# Altium project Motherboard.PrjPcb
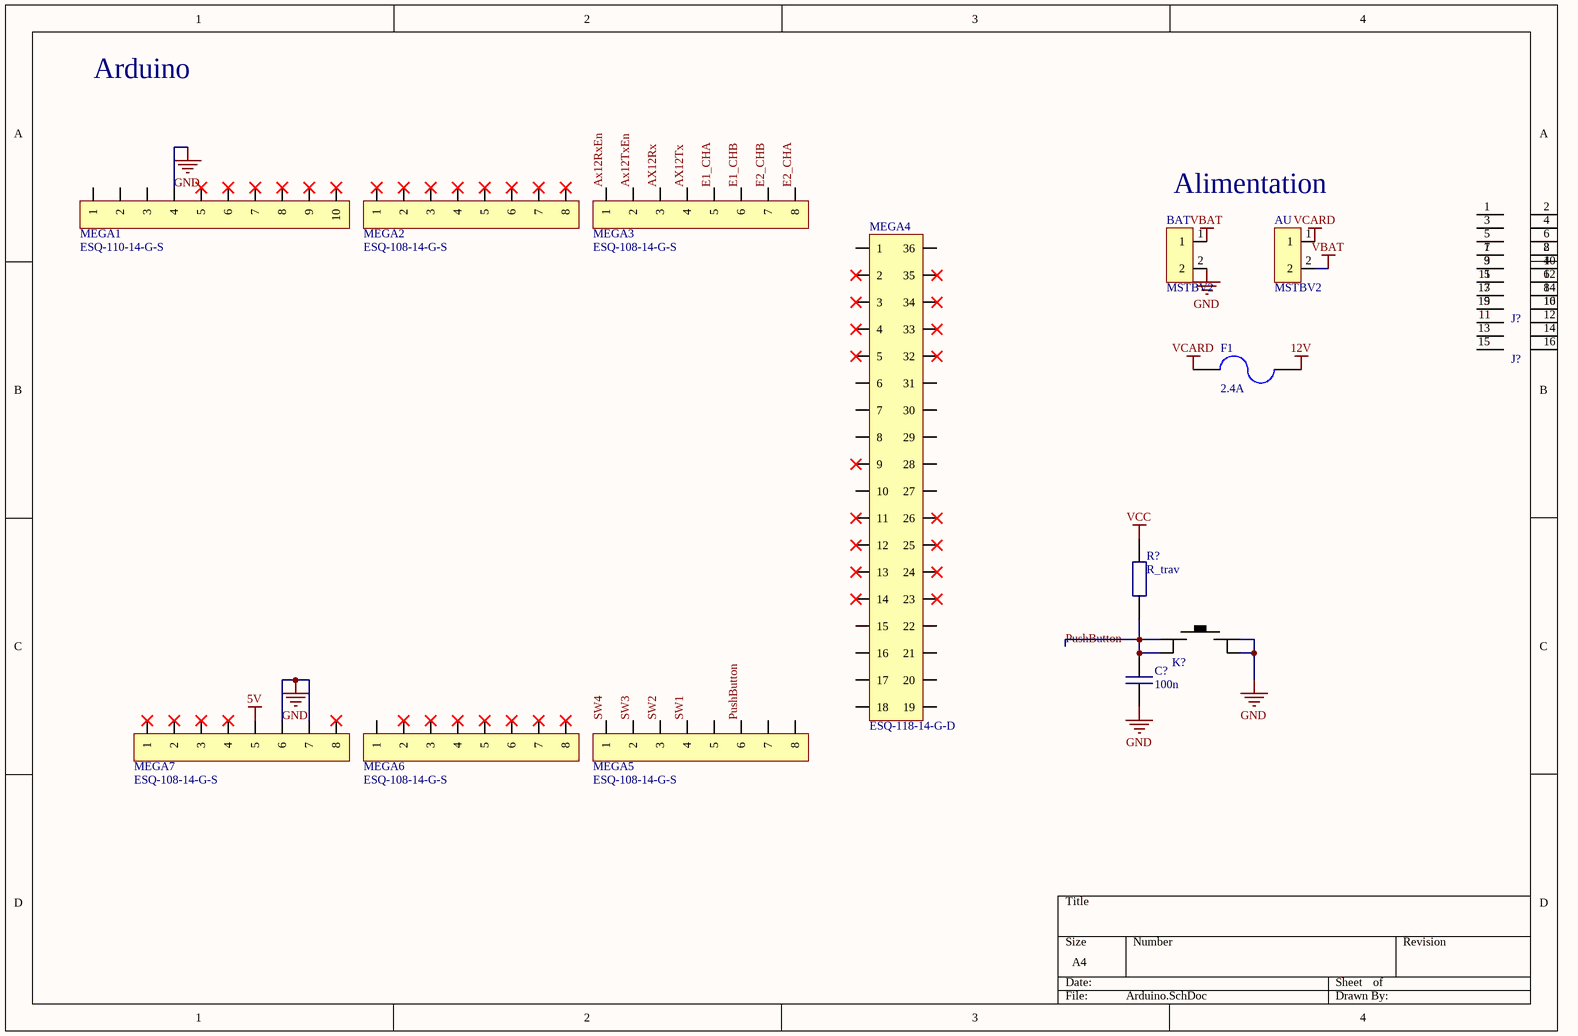
[diagram p0: Arduino.SchDoc]
1 sheet, 15 parts. Net scope: global (net labels, ports and power ports of the same name join across sheets).

## Sheet Arduino.SchDoc
size A4

### Parts
(Parts that share a designator on the sheet are numbered #1, #2 ... from top to bottom, then left to right.)
AU  MSTBV2  [MSTBV2_90]
BAT  MSTBV2  [MSTBV2_90]
C?  100n  [C_2.54mm]
F1  2.4A  [MF-RHT200-0]
J?#1  43045  [43045-1601]  (value not drawn)
J?#2  43045  [43045-1601]  (value not drawn)
K?  B3F-1000  [B3F-1000]  (value not drawn)
MEGA1  ESQ-110-14-G-S  [ESQ-110-14-G-S]
MEGA2  ESQ-108-14-G-S  [ESQ-108-14-G-S]
MEGA3  ESQ-108-14-G-S  [ESQ-108-14-G-S]
MEGA4  ESQ-118-14-G-D  [ESQ-118-14-G-D]
MEGA5  ESQ-108-14-G-S  [ESQ-108-14-G-S]
MEGA6  ESQ-108-14-G-S  [ESQ-108-14-G-S]
MEGA7  ESQ-108-14-G-S  [ESQ-108-14-G-S]
R?  R_trav  [R_250mW_trav]

### Nets
5V: MEGA7.5
12V: F1.2
GND: BAT.2 C?.1 K?.2 K?.4 MEGA1.4 MEGA7.6 MEGA7.7
VBAT: AU.2 BAT.1
VCARD: AU.1 F1.1
VCC: R?.2
AX12Rx: MEGA3.3
Ax12RxEn: MEGA3.1
AX12Tx: MEGA3.4
Ax12TxEn: MEGA3.2
E1_CHA: MEGA3.5
E1_CHB: MEGA3.6
E2_CHA: MEGA3.8
E2_CHB: MEGA3.7
PushButton: C?.2 K?.1 K?.3 MEGA5.6 R?.1
SW1: MEGA5.4
SW2: MEGA5.3
SW3: MEGA5.2
SW4: MEGA5.1
NetJ?#1_7: J?#1.7 J?#2.1
NetJ?#1_8: J?#1.8 J?#2.2
NetJ?#1_9: J?#1.9 J?#2.3
NetJ?#1_10: J?#1.10 J?#2.4
NetJ?#1_11: J?#1.11 J?#2.5
NetJ?#1_12: J?#1.12 J?#2.6
NetJ?#1_13: J?#1.13 J?#2.7
NetJ?#1_14: J?#1.14 J?#2.8
NetJ?#1_15: J?#1.15 J?#2.9
NetJ?#1_16: J?#1.16 J?#2.10

Not connected (* = marked no-connect by the designer): J?#1 1 2 3 4 5 6; J?#2 11 12 13 14 15 16; MEGA1 1 2 3 5* 6* 7* 8* 9* 10*; MEGA2 1* 2* 3* 4* 5* 6* 7* 8*; MEGA4 1 2* 3* 4* 5* 6 7 8 9* 10 11* 12* 13* 14* 15 16 17 18 19 20 21 22 23* 24* 25* 26* 27 28 29 30 31 32* 33* 34* 35* 36; MEGA5 5 7 8; MEGA6 1 2* 3* 4* 5* 6* 7* 8*; MEGA7 1* 2* 3* 4* 8*

### Notes on the sheet
- Arduino
- Alimentation

### Library data of the parts
AU BAT = MSTBV2: Manufacturer: PHOENIX CONTACT; Manufacturer Part Number: MSTBV 2,5/2-GF-5.08; Supplier 1: Farnell; Supplier Part Number 1: 1792792; Pricing: 1=2.61, 10=2.27, 50=1.9, 100=1.71, 250=1.63, 400=1.47, 400=1.32, 4000=1.19 (EUR); ComponentLink1URL: http://www.farnell.com/datasheets/528161.pdf; ComponentLink1Description: http://www.farnell.com/datasheets/528161.pdf; ComponentLink2URL: http://www.farnell.com/cad/1728572.zip; ComponentLink2Description: http://www.farnell.com/cad/1728572.zip
C? = C
F1 = MC33158: Hold Current: 1.1A; farnell: 1800714; trip Current: 2.4A
J?#1 J?#2 = 43045-1601: Manufacturer: MOLEX; Manufacturer Part Number: 43045-1612; Supplier 1: Farnell; Supplier Part Number 1: 9961356; Pricing: 10=2.6, 100=2.08, 250=1.74, 500=1.63, 1000=1.51 (EUR); ComponentLink1URL: http://www.farnell.com/cad/1243826.pdf; ComponentLink1Description: http://www.farnell.com/cad/1243826.pdf; ComponentLink2URL: http://www.farnell.com/datasheets/1802882.pdf; ComponentLink2Description: http://www.farnell.com/datasheets/1802882.pdf
K? = B3F-1000: Manufacturer: OMRON ELECTRONIC COMPONENTS; Manufacturer Part Number: B3F1006; Force, fonctionnement: 4.9; Tension DC nominale du contact: 24; Courant de contact max.: 50; Terminaisons commutateur: A souder; SVHC: No SVHC (20-Jun-2013); Configuration des contacts: SPST-NO; Hauteur: 4.3; Type d'actionnement: Plate<!--FANDB--><div class="features-and-benefits-container"></div>; Supplier 1: Farnell; Supplier Part Number 1: 1960938; Pricing: 1=0.88, 10=0.72, 25=0.6, 50=0.5, 100=0.46, 200=0.414, 200=0.373, 2000=0.263 (EUR); MSL: -; ComponentLink1URL: http://www.farnell.com/datasheets/611570.pdf; ComponentLink1Description: http://www.farnell.com/datasheets/611570.pdf
MEGA1 = ESQ-110-14-G-S: Manufacturer: SAMTEC; Supplier 1: Farnell; Supplier Part Number 1: 1769290; Manufacturer Part Number: ESQ-110-14-G-S; Pricing: 5=4.375, 50=3.012, 100=2.35, 250=1.925, 500=1.75, 2500=1.425 (EUR); ComponentLink1URL: http://www.farnell.com/cad/477214.pdf; ComponentLink1Description: http://www.farnell.com/cad/477214.pdf; ComponentLink2URL: http://www.samtec.com/ftppub/pdf/ESQ_TH.pdf; ComponentLink2Description: http://www.samtec.com/ftppub/pdf/ESQ_TH.pdf
MEGA2 MEGA3 MEGA5-MEGA7 = ESQ-108-14-G-S: Manufacturer: SAMTEC; Supplier 1: Farnell; Supplier Part Number 1: 1769283; Manufacturer Part Number: ESQ-108-14-G-S; Pricing: 5=3.487, 50=2.4, 100=1.875, 250=1.538, 500=1.4, 2500=1.137 (EUR); ComponentLink1URL: http://www.farnell.com/cad/477214.pdf; ComponentLink1Description: http://www.farnell.com/cad/477214.pdf; ComponentLink2URL: http://www.samtec.com/ftppub/pdf/ESQ_TH.pdf; ComponentLink2Description: http://www.samtec.com/ftppub/pdf/ESQ_TH.pdf
MEGA4 = ESQ-118-14-G-D: Manufacturer: SAMTEC; Supplier 1: Farnell; Supplier Part Number 1: 1769197; Manufacturer Part Number: ESQ-118-14-G-D; Pricing: 1=13.413, 10=9.225, 50=6.15, 100=5.475, 250=4.925, 500=4.35 (EUR); ComponentLink1URL: http://www.farnell.com/cad/477214.pdf; ComponentLink1Description: http://www.farnell.com/cad/477214.pdf; ComponentLink2URL: http://www.samtec.com/ftppub/pdf/ESQ_TH.pdf; ComponentLink2Description: http://www.samtec.com/ftppub/pdf/ESQ_TH.pdf